# EAGLE design cml_ring_osc (EAGLE 9.2.2)
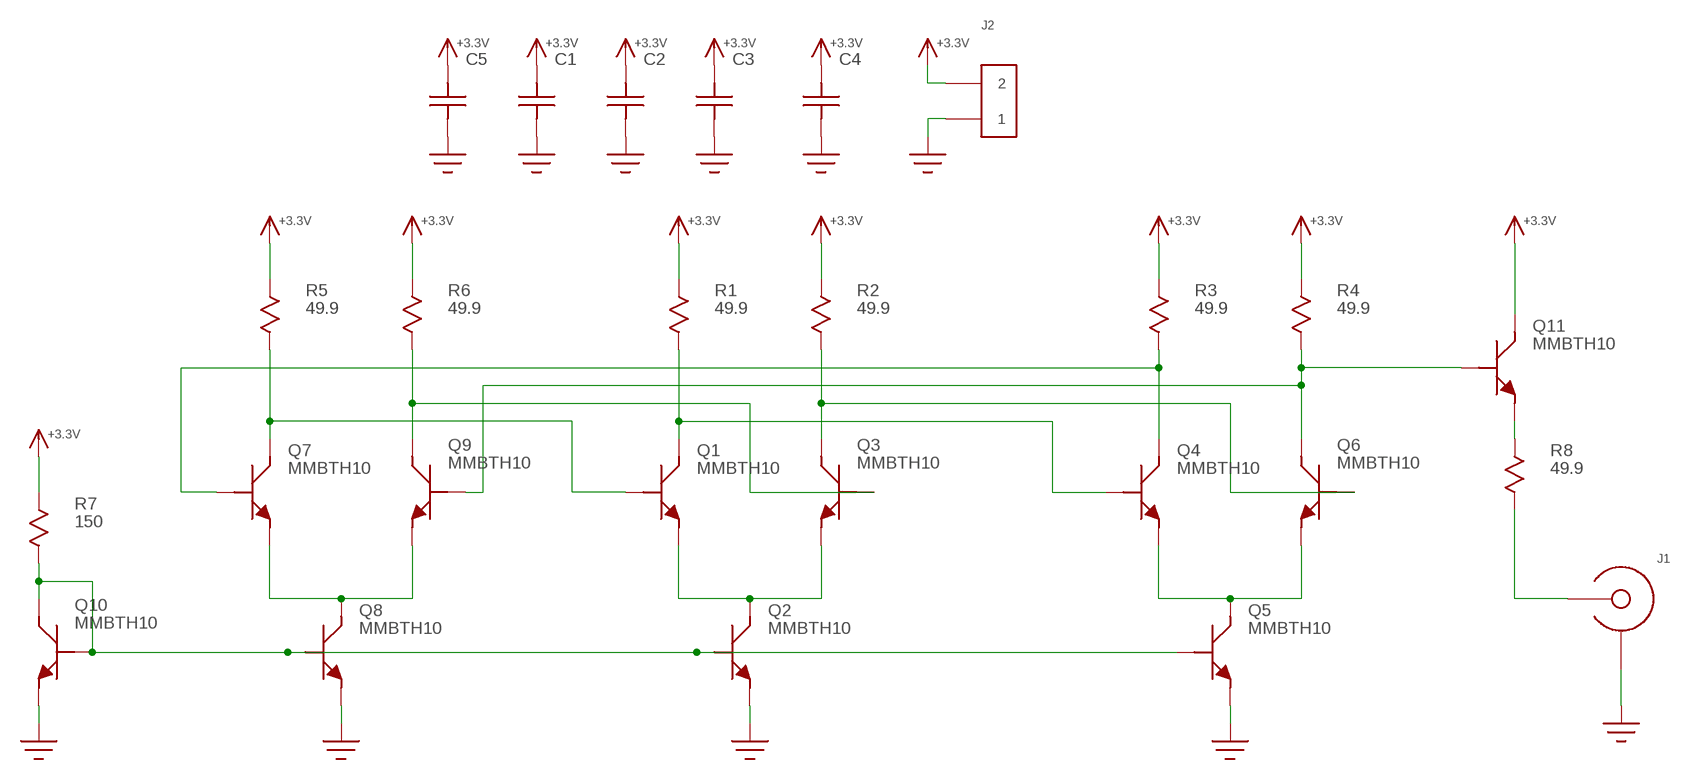
[diagram p0: schematic, sheet 1]

## Parts
C1  C0603  [C0603]
C2  C0603  [C0603]
C3  C0603  [C0603]
C4  C0805  [0805]
C5  C0805  [0805]
J1  EDGE_LAUNCH_JACK  [EDGE_LAUNCH_RF_CON]
J2  HEADER_2PIN  [HEADER_2PIN]
Q1  MMBTH10  [SOT-23]
Q2  MMBTH10  [SOT-23]
Q3  MMBTH10  [SOT-23]
Q4  MMBTH10  [SOT-23]
Q5  MMBTH10  [SOT-23]
Q6  MMBTH10  [SOT-23]
Q7  MMBTH10  [SOT-23]
Q8  MMBTH10  [SOT-23]
Q9  MMBTH10  [SOT-23]
Q10  MMBTH10  [SOT-23]
Q11  MMBTH10  [SOT-23]
R1  49.9  R0603  [R0603]
R2  49.9  R0603  [R0603]
R3  49.9  R0603  [R0603]
R4  49.9  R0603  [R0603]
R5  49.9  R0603  [R0603]
R6  49.9  R0603  [R0603]
R7  150  R0603  [R0603]
R8  49.9  R0805  [R0805]

## Nets
+3.3V: C1.P$2 C2.P$2 C3.P$2 C4.P$2 C5.P$2 J2.2 Q11.3(C) R1.P$1 R2.P$1 R3.P$1 R4.P$1 R5.P$1 R6.P$1 R7.P$1
GND: C1.P$1 C2.P$1 C3.P$1 C4.P$1 C5.P$1 J1.GND@1(SHIELD) J1.GND@2(SHIELD) J1.GND@3(SHIELD) J1.GND@4(SHIELD) J1.GND@5(SHIELD) J1.GND@6(SHIELD) J1.GND@7(SHIELD) J1.GND@8(SHIELD) J1.GND@9(SHIELD) J1.GND@10(SHIELD) J1.GND@11(SHIELD) J1.GND@12(SHIELD) J1.SHIELD@1(SHIELD) J1.SHIELD@2(SHIELD) J2.1 Q2.2(E) Q5.2(E) Q8.2(E) Q10.2(E)
N$1: Q1.3(C) Q4.1(B) R1.P$2
N$2: Q4.3(C) Q7.1(B) R3.P$2
N$3: Q3.3(C) Q6.1(B) R2.P$2
N$4: Q1.2(E) Q2.3(C) Q3.2(E)
N$5: Q6.3(C) Q9.1(B) Q11.1(B) R4.P$2
N$6: Q4.2(E) Q5.3(C) Q6.2(E)
N$7: Q1.1(B) Q7.3(C) R5.P$2
N$8: Q3.1(B) Q9.3(C) R6.P$2
N$9: Q7.2(E) Q8.3(C) Q9.2(E)
N$10: Q2.1(B) Q5.1(B) Q8.1(B) Q10.1(B) Q10.3(C) R7.P$2
N$11: Q11.2(E) R8.P$1
N$12: J1.CENTER R8.P$2

## Library data of the parts
C1-C5 = yapo:C
J1 = yapo:EDGE_LAUNCH_JACK
J2 = yapo:HEADER_2PIN
Q1-Q11 = yapo:MMBTH10
R1-R8 = yapo:R

## Board
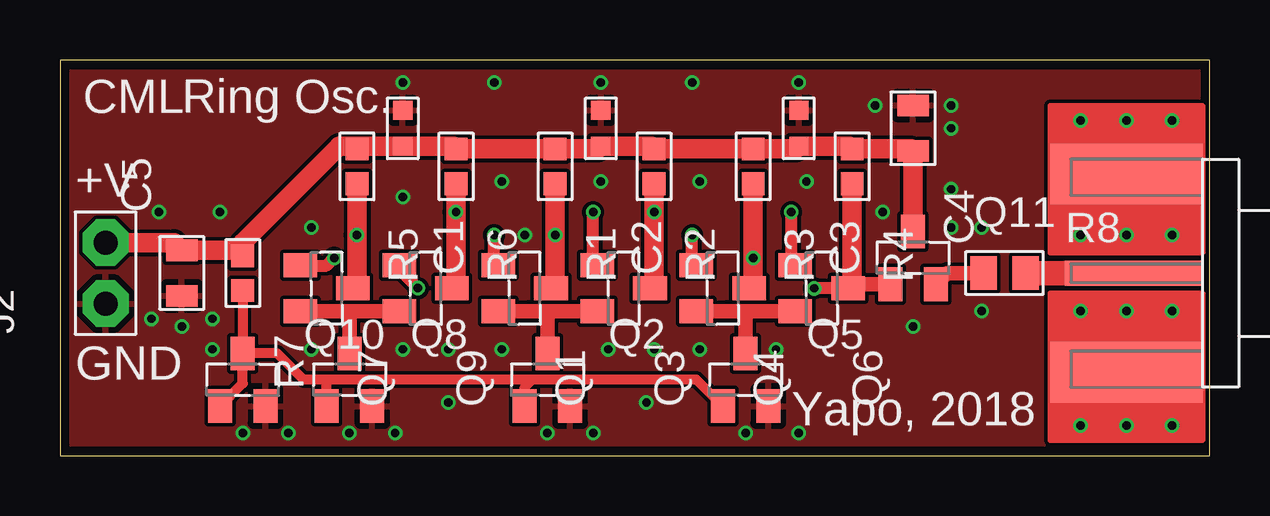
[diagram p1: board, top side]
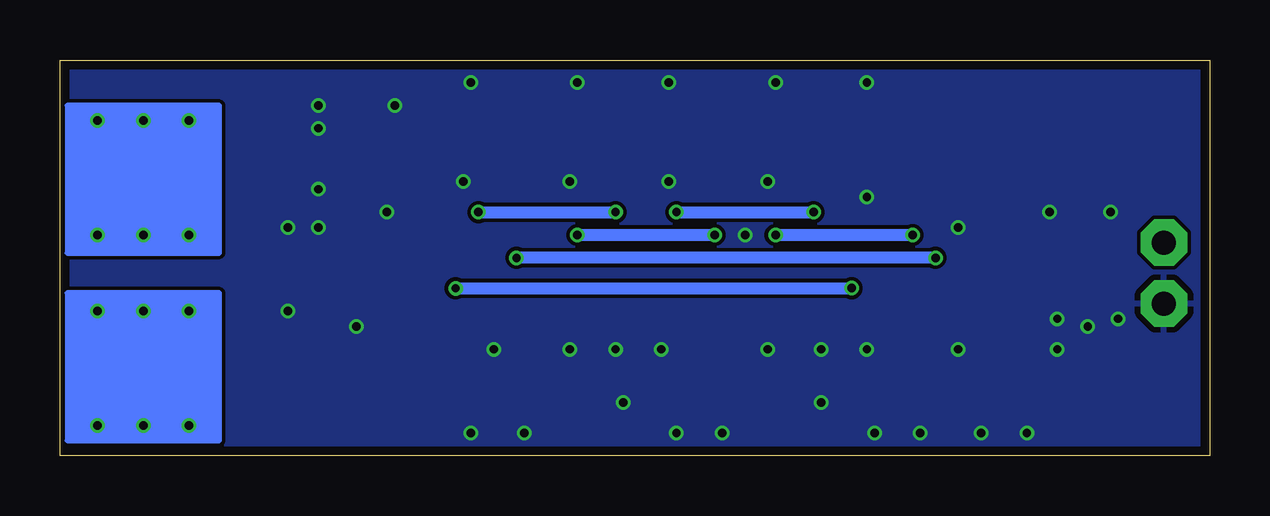
[diagram p2: board, bottom side, seen from below]

Size 47.92 x 16.5 mm. Coordinates in mm from the lower left corner, seen from the top.
Outline: 0,0 47.92,0 47.92,16.5 0,16.5 0,0
Copper layers (1*16): Top 0.035559375mm / dielectric 1.6mm / Bottom 0.035559375mm
Design rules "oshpark-2layer *": minimum track width 6mil, minimum drill 10mil, track to track 6mil, track to pad 6mil, pad to pad 6mil, via to via 6mil, smd to smd 6mil, copper to edge 15mil, drill to drill 6mil, minimum pad ring 5mil, minimum via ring 5mil, stop-mask expansion 2.5mil, vias tented up to drill 20mil, thermal gap 10mil

### Footprints (pad centres in the part's own frame; a part is rotated, then mirrored left to right if it is on the bottom)
C0603 = smd 0.8 x 0.8: P$1 -0.75,0; P$2 0.75,0
0805 = smd 0.9 x 1.3: P$1 -0.95,0; P$2 0.95,0
EDGE_LAUNCH_RF_CON = smd 5.715 x 1.041: CENTER -2.875,0 | drill 0.35: GND@1 -5.08,1.587; GND@2 -3.175,1.587; GND@3 -1.27,1.587; GND@4 -5.08,-1.587; GND@5 -3.175,-1.587; GND@6 -1.27,-1.587; GND@7 -5.08,6.35; GND@8 -3.175,6.35; GND@9 -1.27,6.35; GND@10 -5.08,-6.35; GND@11 -3.175,-6.35; GND@12 -1.27,-6.35 | smd 6.35 x 2.54: SHIELD@1 -3.175,-4.128; SHIELD@2 -3.175,4.128
HEADER_2PIN = drill 1 pad 1.93 octagon: 1 -1.27,0; 2 1.27,0
SOT-23 = smd 1 x 1.4: 1 -0.95,-1.1; 2 0.95,-1.1; 3 0,1.1
R0603 = smd 0.95 x 0.95: P$1 -0.725,0; P$2 0.725,0
R0805 = smd 1.1 x 1.4: P$1 -0.875,0; P$2 0.875,0

### Placement (x,y rotation side)
C1  14.29,13.65 270 top
C2  22.54,13.65 270 top
C3  30.8,13.65 270 top
C4  35.56,13.65 270 top
C5  5.08,7.62 90 top
J1  47.62,7.62 0 top
J2  1.91,7.62 90 top
Q1  19.37,6.99 270 top
Q2  20.32,3.17 0 top
Q3  23.5,6.99 270 top
Q4  27.62,6.99 270 top
Q5  28.57,3.17 0 top
Q6  31.75,6.99 270 top
Q7  11.11,6.99 270 top
Q8  12.06,3.17 0 top
Q9  15.24,6.99 270 top
Q10  7.62,3.17 0 top
Q11  35.56,8.26 0 top
R1  20.64,12.06 270 top
R2  24.77,12.06 270 top
R3  28.89,12.06 270 top
R4  33.02,12.06 270 top
R5  12.38,12.06 270 top
R6  16.51,12.06 270 top
R7  7.62,7.62 270 top
R8  39.37,7.62 0 top

### Tracks (layer width: path | path; a pad name or v marks a point on that pad's centre or on a via)
+3.3V
  Top 0.813: Q11.3 C4.P$2 35.47,12.79 R4.P$1 32.91,12.9 C3.P$2 30.68,12.79 R3.P$1 R2.P$1 24.65,12.9 C2.P$2 22.43,12.79 R1.P$1 R6.P$1 16.4,12.9 C1.P$2 12.49,12.9 | R5.P$1 12.49,12.9 | J2.2 4.76,8.89 C5.P$2 7.39,8.57 R7.P$1 7.62,8.89 11.63,12.9 12.49,12.9
GND  (via drill 0.35)
  other vias: 14.29,15.56 22.54,15.56 30.8,15.56 33.97,14.61 37.15,14.61 30.8,0.95 28.57,0.95 22.23,0.95 20.32,0.95 13.97,0.95 12.06,0.95 9.53,0.95 7.62,0.95 3.81,5.71 5.08,5.4 6.35,5.71 37.15,13.65 18.1,15.56 26.35,15.56 16.19,2.22 24.45,2.22 10.48,4.45 10.48,9.53 14.29,10.79 18.41,11.43 22.54,11.43 26.67,11.43 14.29,4.45 16.19,4.45 18.41,4.45 22.86,4.45 24.77,4.45 26.67,4.45 6.35,4.45 29.84,4.45 31.11,11.43 35.56,5.4 34.29,10.16 37.15,11.11 37.15,9.53 38.42,6.03 38.42,9.53 4.13,10.16 6.67,10.16 19.37,9.21
  pour Top: 0,16.51 47.94,16.51 47.94,0 0,0
  pour Bottom: 0,16.51 47.94,16.51 47.94,0 0,0
N$1  (via drill 0.35)
  Top 0.508: 26.35,8.11 v26.35,9.21
  Top 0.61: Q4.1 26.35,8.11
  Top 0.813: R1.P$2 v20.64,9.21 20.64,7.16 Q1.3
  Bottom 0.508: v26.35,9.21 v20.64,9.21
N$2  (via drill 0.35)
  Top 0.508: Q7.1 11.11,7.93 v11.43,8.26
  Top 0.813: R3.P$2 v28.89,8.26 28.89,7.16 Q4.3
  Bottom 0.508: v11.43,8.26 v28.89,8.26
N$3  (via drill 0.35)
  Top 0.508: 30.48,8.11 v30.48,10.16
  Top 0.61: Q6.1 30.48,8.11
  Top 0.813: R2.P$2 v24.77,10.16 24.77,7.16 Q3.3
  Bottom 0.508: v30.48,10.16 v24.77,10.16
N$4
  Top 0.61: Q1.2 19.57,6.04 19.58,6.03 20.32,6.03 | 20.32,6.03 21.36,6.03 21.36,6.04 Q3.2 | Q2.3 20.32,6.03
N$5  (via drill 0.35)
  Top 0.508: Q6.3 v31.43,6.99 | v14.92,6.99 14.14,7.77 Q9.1
  Top 0.61: Q11.1 33.02,7.16
  Top 0.813: R4.P$2 33.02,7.16 Q6.3
  Bottom 0.508: v31.43,6.99 v14.92,6.99
N$6
  Top 0.61: Q4.2 27.83,6.04 27.83,6.03 28.57,6.03 | 28.57,6.03 29.61,6.03 29.62,6.04 Q6.2 | Q5.3 28.57,6.03
N$7  (via drill 0.35)
  Top 0.508: 18.1,8.11 v18.1,9.21
  Top 0.61: Q1.1 18.1,8.11
  Top 0.813: R5.P$2 v12.38,9.21 12.38,7.16 Q7.3
  Bottom 0.508: v18.1,9.21 v12.38,9.21
N$8  (via drill 0.35)
  Top 0.508: 22.23,8.11 v22.23,10.16
  Top 0.61: Q3.1 22.23,8.11
  Top 0.813: R6.P$2 v16.51,10.16 16.51,7.16 Q9.3
  Bottom 0.508: v22.23,10.16 v16.51,10.16
N$9
  Top 0.61: Q7.2 11.32,6.04 11.32,6.03 12.06,6.03 | 12.06,6.03 13.1,6.03 13.11,6.04 Q9.2 | Q8.3 12.06,6.03
N$10
  Top 0.406: Q5.1 26.52,3.17 19.68,3.17 | 19.68,3.17 11.11,3.17 | 11.11,3.17 10.16,3.17 9.06,4.28 Q10.3 | Q8.1 11.11,3.17 | Q2.1 19.37,2.86 19.68,3.17 | R7.P$2 Q10.3 | Q10.1 7.62,3.02 Q10.3
N$11
  Top 0.61: Q11.2 36.98,7.62 R8.P$1
N$12
  Top 1.016: J1.CENTER R8.P$2

### Text on the board
tPlace: CML | Ring Osc. | +V | GND | Yapo, 2018